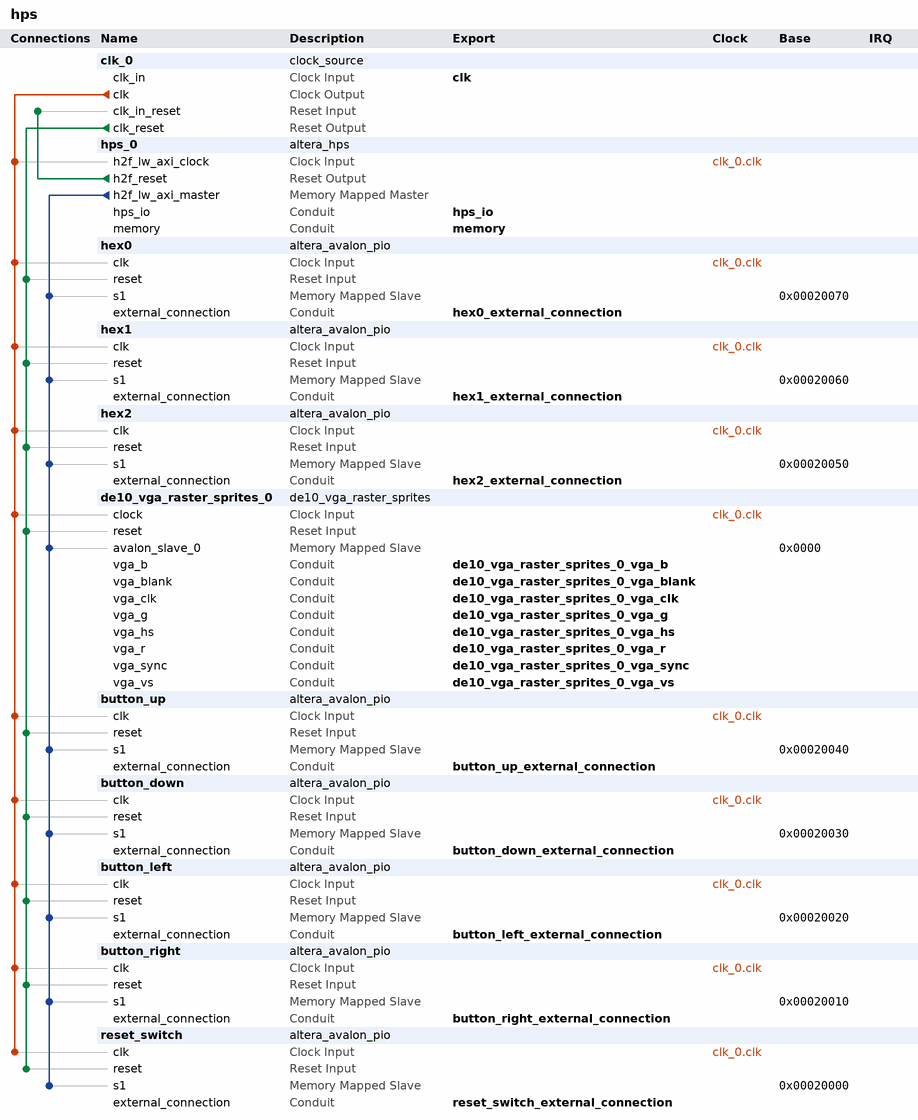
[diagram p0: system contents]
# Platform Designer (Qsys) system hps, Cyclone V 5CSXFC6D6F31C6
# Parameters at their usual value, and those the tool derives, are not listed.
package require -exact qsys 18.1
create_system hps
set_project_property DEVICE_FAMILY {Cyclone V}
set_project_property DEVICE 5CSXFC6D6F31C6

add_instance clk_0 clock_source 18.1
set_instance_parameter_value clk_0 clockFrequency 50000000

add_instance hps_0 altera_hps 18.1
set_instance_parameter_value hps_0 EMAC1_Mode RGMII
set_instance_parameter_value hps_0 EMAC1_PinMuxing {HPS I/O Set 0}
set_instance_parameter_value hps_0 F2SCLK_COLDRST_Enable false
set_instance_parameter_value hps_0 F2SCLK_DBGRST_Enable false
set_instance_parameter_value hps_0 F2SCLK_WARMRST_Enable false
set_instance_parameter_value hps_0 F2SINTERRUPT_Enable false
set_instance_parameter_value hps_0 F2S_Width 0
set_instance_parameter_value hps_0 FPGA_PERIPHERAL_OUTPUT_CLOCK_FREQ_EMAC0_GTX_CLK 125
set_instance_parameter_value hps_0 FPGA_PERIPHERAL_OUTPUT_CLOCK_FREQ_EMAC0_MD_CLK 2.5
set_instance_parameter_value hps_0 FPGA_PERIPHERAL_OUTPUT_CLOCK_FREQ_EMAC1_GTX_CLK 125
set_instance_parameter_value hps_0 FPGA_PERIPHERAL_OUTPUT_CLOCK_FREQ_EMAC1_MD_CLK 2.5
set_instance_parameter_value hps_0 HPS_PROTOCOL DDR3
set_instance_parameter_value hps_0 I2C0_Mode N/A
set_instance_parameter_value hps_0 I2C0_PinMuxing Unused
set_instance_parameter_value hps_0 I2C1_Mode N/A
set_instance_parameter_value hps_0 I2C1_PinMuxing Unused
set_instance_parameter_value hps_0 LWH2F_Enable true
set_instance_parameter_value hps_0 MEM_BANKADDR_WIDTH 3
set_instance_parameter_value hps_0 MEM_CLK_FREQ 400.0
set_instance_parameter_value hps_0 MEM_CLK_FREQ_MAX 400.0
set_instance_parameter_value hps_0 MEM_COL_ADDR_WIDTH 10
set_instance_parameter_value hps_0 MEM_DQ_WIDTH 32
set_instance_parameter_value hps_0 MEM_DRV_STR RZQ/6
set_instance_parameter_value hps_0 MEM_ROW_ADDR_WIDTH 15
set_instance_parameter_value hps_0 MEM_RTT_NOM RZQ/6
set_instance_parameter_value hps_0 MEM_RTT_WR {Dynamic ODT off}
set_instance_parameter_value hps_0 MEM_TCL 11
set_instance_parameter_value hps_0 MEM_TFAW_NS 45.0
set_instance_parameter_value hps_0 MEM_TRAS_NS 35.0
set_instance_parameter_value hps_0 MEM_TRCD_NS 13.75
set_instance_parameter_value hps_0 MEM_TRFC_NS 260.0
set_instance_parameter_value hps_0 MEM_TRP_NS 13.75
set_instance_parameter_value hps_0 MEM_VENDOR Micron
set_instance_parameter_value hps_0 MEM_WTCL 7
set_instance_parameter_value hps_0 QSPI_Mode N/A
set_instance_parameter_value hps_0 QSPI_PinMuxing Unused
set_instance_parameter_value hps_0 REF_CLK_FREQ 25.0
set_instance_parameter_value hps_0 S2FCLK_USER2CLK 5
set_instance_parameter_value hps_0 S2F_Width 0
set_instance_parameter_value hps_0 SDIO_Mode {4-bit Data}
set_instance_parameter_value hps_0 SDIO_PinMuxing {HPS I/O Set 0}
set_instance_parameter_value hps_0 SPIM1_Mode N/A
set_instance_parameter_value hps_0 SPIM1_PinMuxing Unused
set_instance_parameter_value hps_0 STM_Enable false
set_instance_parameter_value hps_0 TIMING_BOARD_AC_SKEW 0.02
set_instance_parameter_value hps_0 TIMING_BOARD_AC_TO_CK_SKEW 0.01
set_instance_parameter_value hps_0 TIMING_BOARD_DQ_TO_DQS_SKEW 0.05
set_instance_parameter_value hps_0 TIMING_BOARD_MAX_CK_DELAY 0.03
set_instance_parameter_value hps_0 TIMING_BOARD_MAX_DQS_DELAY 0.02
set_instance_parameter_value hps_0 TIMING_BOARD_SKEW_BETWEEN_DQS 0.06
set_instance_parameter_value hps_0 TIMING_BOARD_SKEW_CKDQS_DIMM_MAX 0.12
set_instance_parameter_value hps_0 TIMING_BOARD_SKEW_CKDQS_DIMM_MIN 0.06
set_instance_parameter_value hps_0 TIMING_BOARD_SKEW_WITHIN_DQS 0.01
set_instance_parameter_value hps_0 TIMING_TDH 65
set_instance_parameter_value hps_0 TIMING_TDQSCK 255
set_instance_parameter_value hps_0 TIMING_TDQSQ 125
set_instance_parameter_value hps_0 TIMING_TDS 30
set_instance_parameter_value hps_0 TIMING_TIH 140
set_instance_parameter_value hps_0 TIMING_TIS 190
set_instance_parameter_value hps_0 TIMING_TQSH 0.4
set_instance_parameter_value hps_0 UART0_Mode {No Flow Control}
set_instance_parameter_value hps_0 UART0_PinMuxing {HPS I/O Set 0}
set_instance_parameter_value hps_0 USB1_Mode SDR
set_instance_parameter_value hps_0 USB1_PinMuxing {HPS I/O Set 0}
set_instance_parameter_value hps_0 desired_cfg_clk_mhz 100.0
set_instance_parameter_value hps_0 desired_qspi_clk_mhz 400.0

add_instance hex0 altera_avalon_pio 18.1
set_instance_parameter_value hex0 direction Output
set_instance_parameter_value hex0 width 4

add_instance hex1 altera_avalon_pio 18.1
set_instance_parameter_value hex1 direction Output
set_instance_parameter_value hex1 width 4

add_instance hex2 altera_avalon_pio 18.1
set_instance_parameter_value hex2 direction Output
set_instance_parameter_value hex2 width 4

add_instance de10_vga_raster_sprites_0 de10_vga_raster_sprites 1.6

add_instance button_up altera_avalon_pio 18.1
set_instance_parameter_value button_up direction Input
set_instance_parameter_value button_up width 1

add_instance button_down altera_avalon_pio 18.1
set_instance_parameter_value button_down direction Input
set_instance_parameter_value button_down width 1

add_instance button_left altera_avalon_pio 18.1
set_instance_parameter_value button_left direction Input
set_instance_parameter_value button_left width 1

add_instance button_right altera_avalon_pio 18.1
set_instance_parameter_value button_right direction Input
set_instance_parameter_value button_right width 1

add_instance reset_switch altera_avalon_pio 18.1
set_instance_parameter_value reset_switch direction Input
set_instance_parameter_value reset_switch width 1

# connections
add_connection clk_0.clk button_down.clk clock
add_connection clk_0.clk button_left.clk clock
add_connection clk_0.clk button_right.clk clock
add_connection clk_0.clk button_up.clk clock
add_connection clk_0.clk de10_vga_raster_sprites_0.clock clock
add_connection clk_0.clk hex0.clk clock
add_connection clk_0.clk hex1.clk clock
add_connection clk_0.clk hex2.clk clock
add_connection clk_0.clk hps_0.h2f_lw_axi_clock clock
add_connection clk_0.clk reset_switch.clk clock
add_connection clk_0.clk_reset button_down.reset reset
add_connection clk_0.clk_reset button_left.reset reset
add_connection clk_0.clk_reset button_right.reset reset
add_connection clk_0.clk_reset button_up.reset reset
add_connection clk_0.clk_reset de10_vga_raster_sprites_0.reset reset
add_connection clk_0.clk_reset hex0.reset reset
add_connection clk_0.clk_reset hex1.reset reset
add_connection clk_0.clk_reset hex2.reset reset
add_connection clk_0.clk_reset reset_switch.reset reset
add_connection hps_0.h2f_reset clk_0.clk_in_reset reset
add_connection hps_0.h2f_lw_axi_master button_down.s1 avalon
set_connection_parameter_value hps_0.h2f_lw_axi_master/button_down.s1 baseAddress 0x00020030
add_connection hps_0.h2f_lw_axi_master button_left.s1 avalon
set_connection_parameter_value hps_0.h2f_lw_axi_master/button_left.s1 baseAddress 0x00020020
add_connection hps_0.h2f_lw_axi_master button_right.s1 avalon
set_connection_parameter_value hps_0.h2f_lw_axi_master/button_right.s1 baseAddress 0x00020010
add_connection hps_0.h2f_lw_axi_master button_up.s1 avalon
set_connection_parameter_value hps_0.h2f_lw_axi_master/button_up.s1 baseAddress 0x00020040
add_connection hps_0.h2f_lw_axi_master de10_vga_raster_sprites_0.avalon_slave_0 avalon
set_connection_parameter_value hps_0.h2f_lw_axi_master/de10_vga_raster_sprites_0.avalon_slave_0 baseAddress 0x0000
add_connection hps_0.h2f_lw_axi_master hex0.s1 avalon
set_connection_parameter_value hps_0.h2f_lw_axi_master/hex0.s1 baseAddress 0x00020070
add_connection hps_0.h2f_lw_axi_master hex1.s1 avalon
set_connection_parameter_value hps_0.h2f_lw_axi_master/hex1.s1 baseAddress 0x00020060
add_connection hps_0.h2f_lw_axi_master hex2.s1 avalon
set_connection_parameter_value hps_0.h2f_lw_axi_master/hex2.s1 baseAddress 0x00020050
add_connection hps_0.h2f_lw_axi_master reset_switch.s1 avalon
set_connection_parameter_value hps_0.h2f_lw_axi_master/reset_switch.s1 baseAddress 0x00020000

# exported interfaces
add_interface button_down_external_connection conduit end
set_interface_property button_down_external_connection EXPORT_OF button_down.external_connection
add_interface button_left_external_connection conduit end
set_interface_property button_left_external_connection EXPORT_OF button_left.external_connection
add_interface button_right_external_connection conduit end
set_interface_property button_right_external_connection EXPORT_OF button_right.external_connection
add_interface button_up_external_connection conduit end
set_interface_property button_up_external_connection EXPORT_OF button_up.external_connection
add_interface clk clock sink
set_interface_property clk EXPORT_OF clk_0.clk_in
add_interface de10_vga_raster_sprites_0_vga_b conduit end
set_interface_property de10_vga_raster_sprites_0_vga_b EXPORT_OF de10_vga_raster_sprites_0.vga_b
add_interface de10_vga_raster_sprites_0_vga_blank conduit end
set_interface_property de10_vga_raster_sprites_0_vga_blank EXPORT_OF de10_vga_raster_sprites_0.vga_blank
add_interface de10_vga_raster_sprites_0_vga_clk conduit end
set_interface_property de10_vga_raster_sprites_0_vga_clk EXPORT_OF de10_vga_raster_sprites_0.vga_clk
add_interface de10_vga_raster_sprites_0_vga_g conduit end
set_interface_property de10_vga_raster_sprites_0_vga_g EXPORT_OF de10_vga_raster_sprites_0.vga_g
add_interface de10_vga_raster_sprites_0_vga_hs conduit end
set_interface_property de10_vga_raster_sprites_0_vga_hs EXPORT_OF de10_vga_raster_sprites_0.vga_hs
add_interface de10_vga_raster_sprites_0_vga_r conduit end
set_interface_property de10_vga_raster_sprites_0_vga_r EXPORT_OF de10_vga_raster_sprites_0.vga_r
add_interface de10_vga_raster_sprites_0_vga_sync conduit end
set_interface_property de10_vga_raster_sprites_0_vga_sync EXPORT_OF de10_vga_raster_sprites_0.vga_sync
add_interface de10_vga_raster_sprites_0_vga_vs conduit end
set_interface_property de10_vga_raster_sprites_0_vga_vs EXPORT_OF de10_vga_raster_sprites_0.vga_vs
add_interface hex0_external_connection conduit end
set_interface_property hex0_external_connection EXPORT_OF hex0.external_connection
add_interface hex1_external_connection conduit end
set_interface_property hex1_external_connection EXPORT_OF hex1.external_connection
add_interface hex2_external_connection conduit end
set_interface_property hex2_external_connection EXPORT_OF hex2.external_connection
add_interface hps_io conduit end
set_interface_property hps_io EXPORT_OF hps_0.hps_io
add_interface memory conduit end
set_interface_property memory EXPORT_OF hps_0.memory
add_interface reset_switch_external_connection conduit end
set_interface_property reset_switch_external_connection EXPORT_OF reset_switch.external_connection

set_interconnect_requirement {$system} qsys_mm.clockCrossingAdapter HANDSHAKE
set_interconnect_requirement {$system} qsys_mm.enableEccProtection FALSE
set_interconnect_requirement {$system} qsys_mm.insertDefaultSlave FALSE
set_interconnect_requirement {$system} qsys_mm.maxAdditionalLatency 1

save_system hps.qsys
